# Altium schematic sheet schematicdraft1.SchDoc
size A4; SheetNumber: 1; SheetTotal: 2
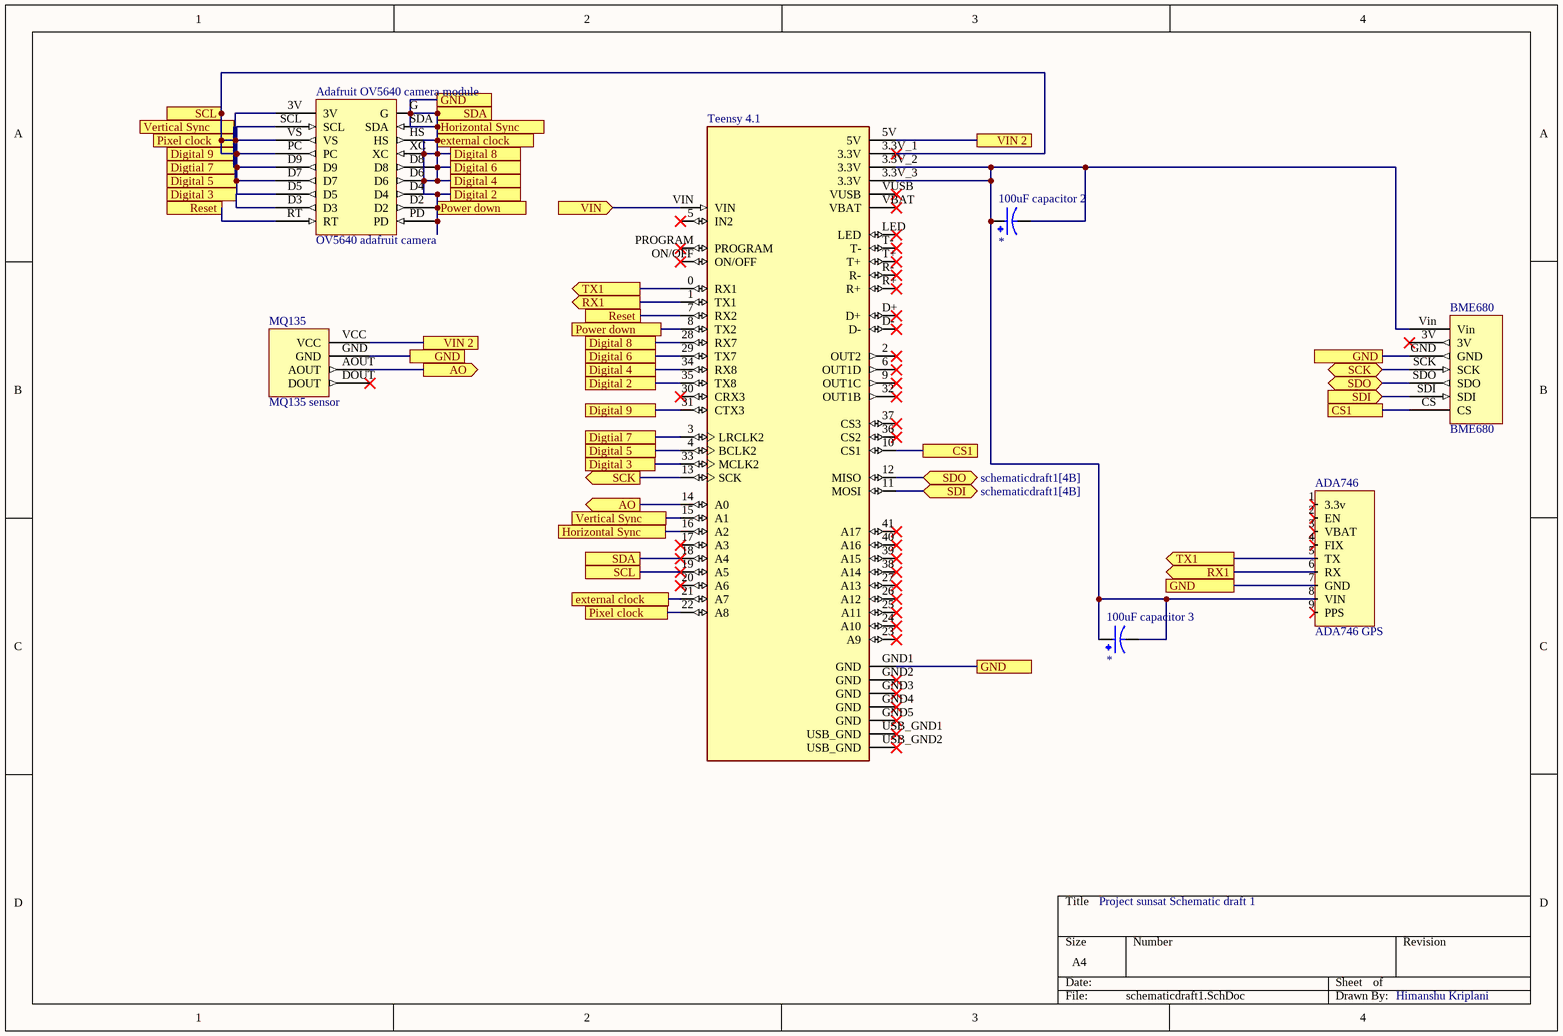
[diagram p0: schematicdraft1.SchDoc]

## Parts
100uF_capacitor_2  EEUTA1V101  [CAPPRD500W60D1000H1250]  (value not drawn)
100uF_capacitor_3  EEUTA1V101  [CAPPRD500W60D1000H1250]  (value not drawn)
ADA746  ADA746 GPS  [ADA746 GPS footprint]
Adafruit_OV5640_camera_module  OV5640 adafruit camera  [OV5640 footprint]
BME680  BME680  [BME 680 footprint]
MQ135  MQ135 sensor  [MQ135 footprint]
Teensy_4.1  Teensy 4.1  [MODULE_DEV-16771]  (value not drawn)

## Ports
AO (out, see schematicdraft1[2B]), CS1 (see schematicdraft1[3B]), CS1 (see schematicdraft1[4B]), Digital 2 (see schematicdraft1[2A]), Digital 2 (see schematicdraft1[2B]), Digital 3 (see schematicdraft1[1A]), Digital 3 (see schematicdraft1[2B]), Digital 4 (see schematicdraft1[2A]), Digital 4 (see schematicdraft1[2B]), Digital 5 (see schematicdraft1[1A]), Digital 5 (see schematicdraft1[2B]), Digital 6 (see schematicdraft1[2A]), Digital 6 (see schematicdraft1[2B]), Digital 8 (see schematicdraft1[2A]), Digital 8 (see schematicdraft1[2B]), Digital 9 (see schematicdraft1[1A]), Digital 9 (see schematicdraft1[2B]), Digtial 7 (see schematicdraft1[1A]), Digtial 7 (see schematicdraft1[2B]), external clock (see schematicdraft1[2A]), external clock (see schematicdraft1[2C]), GND (see schematicdraft1[2A], schematicdraft1[2B], schematicdraft1[3C]), GND (see schematicdraft1[2A], schematicdraft1[2B], schematicdraft1[3C], schematicdraft1[4B]), GND (see schematicdraft1[2A], schematicdraft1[3C], schematicdraft1[4B]), GND (see schematicdraft1[2B], schematicdraft1[3C], schematicdraft1[4B]), Horizontal Sync (see schematicdraft1[2A]), Horizontal Sync (see schematicdraft1[2C]), Pixel clock (see schematicdraft1[1A]), Pixel clock (see schematicdraft1[2C]), Power down (see schematicdraft1[2A]), Power down (see schematicdraft1[2B]), Reset (see schematicdraft1[1A]), Reset (see schematicdraft1[2B]), RX1 (out, see schematicdraft1[2B]), RX1 (out, see schematicdraft1[3C]), SCK (bidir, see schematicdraft1[2B]), SCK (out, see schematicdraft1[4B]), SCL (see schematicdraft1[1A]), SCL (see schematicdraft1[2C]), SDA (see schematicdraft1[2A]), SDA (see schematicdraft1[2C]), SDI (bidir, see schematicdraft1[4B]), SDI (in, see schematicdraft1[3B]), SDO (bidir, see schematicdraft1[3B]), SDO (bidir, see schematicdraft1[4B]), TX1 (out, see schematicdraft1[2B]), TX1 (out, see schematicdraft1[3C]), Vertical Sync (see schematicdraft1[1A]), Vertical Sync (see schematicdraft1[2C]), VIN 2 (see schematicdraft1[2B]), VIN 2 (see schematicdraft1[3A]), VIN (in, see powercircuitschematicdraft1[2B])

## Nets
AO: MQ135.AOUT Teensy_4.1.14(A0) ; port AO
CS1: BME680.CS Teensy_4.1.10(CS1) ; port CS1
Digital 2: ADA746.7(GND) Adafruit_OV5640_camera_module.D2 Adafruit_OV5640_camera_module.D4 Adafruit_OV5640_camera_module.D6 Adafruit_OV5640_camera_module.D8 Adafruit_OV5640_camera_module.G Adafruit_OV5640_camera_module.HS Adafruit_OV5640_camera_module.PD Adafruit_OV5640_camera_module.SDA Adafruit_OV5640_camera_module.XC BME680.GND MQ135.GND Teensy_4.1.8(TX2) Teensy_4.1.16(A2) Teensy_4.1.18(A4) Teensy_4.1.21(A7) Teensy_4.1.28(RX7) Teensy_4.1.29(TX7) Teensy_4.1.34(RX8) Teensy_4.1.35(TX8) Teensy_4.1.GND1(GND) ; port GND, port SDA, port Power down, port Digital 8, port Digital 6, port Digital 4, port Digital 2, port Horizontal Sync, port external clock
Digital 3: Adafruit_OV5640_camera_module.D3 Teensy_4.1.33(MCLK2) ; port Digital 3
Digital 5: Adafruit_OV5640_camera_module.3V Adafruit_OV5640_camera_module.D5 Adafruit_OV5640_camera_module.D7 Adafruit_OV5640_camera_module.D9 Adafruit_OV5640_camera_module.PC Adafruit_OV5640_camera_module.SCL Adafruit_OV5640_camera_module.VS Teensy_4.1.3(LRCLK2) Teensy_4.1.3.3V_1(3.3V) Teensy_4.1.4(BCLK2) Teensy_4.1.15(A1) Teensy_4.1.19(A5) Teensy_4.1.22(A8) Teensy_4.1.31(CTX3) ; port SCL, port Digital 5, port Digtial 7, port Digital 9, port Vertical Sync, port Pixel clock
Reset: Adafruit_OV5640_camera_module.RT Teensy_4.1.7(RX2) ; port Reset
RX1: ADA746.6(RX) Teensy_4.1.1(TX1) ; port RX1
SCK: BME680.SCK Teensy_4.1.13(SCK) ; port SCK
SDI: BME680.SDI Teensy_4.1.11(MOSI) ; port SDI
SDO: BME680.SDO Teensy_4.1.12(MISO) ; port SDO
TX1: ADA746.5(TX) Teensy_4.1.0(RX1) ; port TX1
VIN: Teensy_4.1.VIN ; port VIN
VIN 2: MQ135.VCC Teensy_4.1.5V ; port VIN 2
Net100uF_capacitor_2_N: 100uF_capacitor_2.N 100uF_capacitor_2.P 100uF_capacitor_3.N 100uF_capacitor_3.P ADA746.8(VIN) BME680.Vin Teensy_4.1.3.3V_2(3.3V) Teensy_4.1.3.3V_3(3.3V)

Not connected (* = marked no-connect by the designer): ADA746 1(3.3v)* 2(EN)* 3(VBAT)* 4(FIX)* 9(PPS)*; BME680 3V(3V_)*; MQ135 DOUT*; Teensy_4.1 2(OUT2)* 5(IN2)* 6(OUT1D)* 9(OUT1C)* 17(A3)* 20(A6)* 23(A9)* 24(A10)* 25(A11)* 26(A12)* 27(A13)* 30(CRX3)* 32(OUT1B)* 36(CS2)* 37(CS3)* 38(A14)* 39(A15)* 40(A16)* 41(A17)* D+* D-* GND2(GND)* GND3(GND)* GND4(GND)* GND5(GND)* LED* ON/OFF* PROGRAM* R+* R-* T+* T-* USB_GND1(USB_GND)* USB_GND2(USB_GND)* VBAT* VUSB*

## Notes on the sheet
- Project sunsat Schematic draft 1
- Himanshu Kriplani

## Library data of the parts
100uF_capacitor_2 100uF_capacitor_3 = CMP-007-000000-1: CAP ALUM 100UF 20% 35V RADIAL; MF: Panasonic; Package: RADIAL-2 Panasonic; SnapEDA_Link: https://www.snapeda.com/parts/EEUTA1V101/Panasonic/view-part/5783936/?ref=snap; Availability: In Stock; Source: EEUTA1V101.SchLib; Component Type: Standard; MP: EEUTA1V101; Check_prices: https://www.snapeda.com/parts/EEUTA1V101/Panasonic/view-part/5783936/?ref=eda; Pin Count: 2; Value: *; Price: None; Design Item ID: EEUTA1V101
ADA746 = CMP-010-00025-3: I created this library because I didnot find an existing one
Adafruit_OV5640_camera_module = CMP-010-00028-3: Adafruit OV5640 camera
BME680 = CMP-010-00024-6: Temperature and pressure sensor
MQ135 = CMP-010-00026-3: New schematic and footprint for the MQ135 CO2 sensor
Teensy_4.1 = CMP-003-000000-1: RT1062 Teensy 4.1 series ARMÂ® CortexÂ®-M7 MPU Embedded Evaluation Board; MF: SparkFun Electronics; MP: DEV-16771; Package: None; Component Type: Standard; Pin Count: 65; Purchase-URL: https://pricing.snapeda.com/search/part/DEV-16771/?ref=eda; SnapEDA_Link: https://www.snapeda.com/parts/DEV-16771/SparkFun+Electronics/view-part/?ref=snap; Availability: In Stock; Source: DEV-16771.SchLib; Design Item ID: DEV-16771; Check_prices: https://www.snapeda.com/parts/DEV-16771/SparkFun+Electronics/view-part/?ref=eda; Value: *; Price: None